# Altium schematic sheet SolidStateTeslaCoil_GateCoilDriver_SCHEMATIC.SchDoc
size A; SheetNumber: 2; SheetTotal: 2
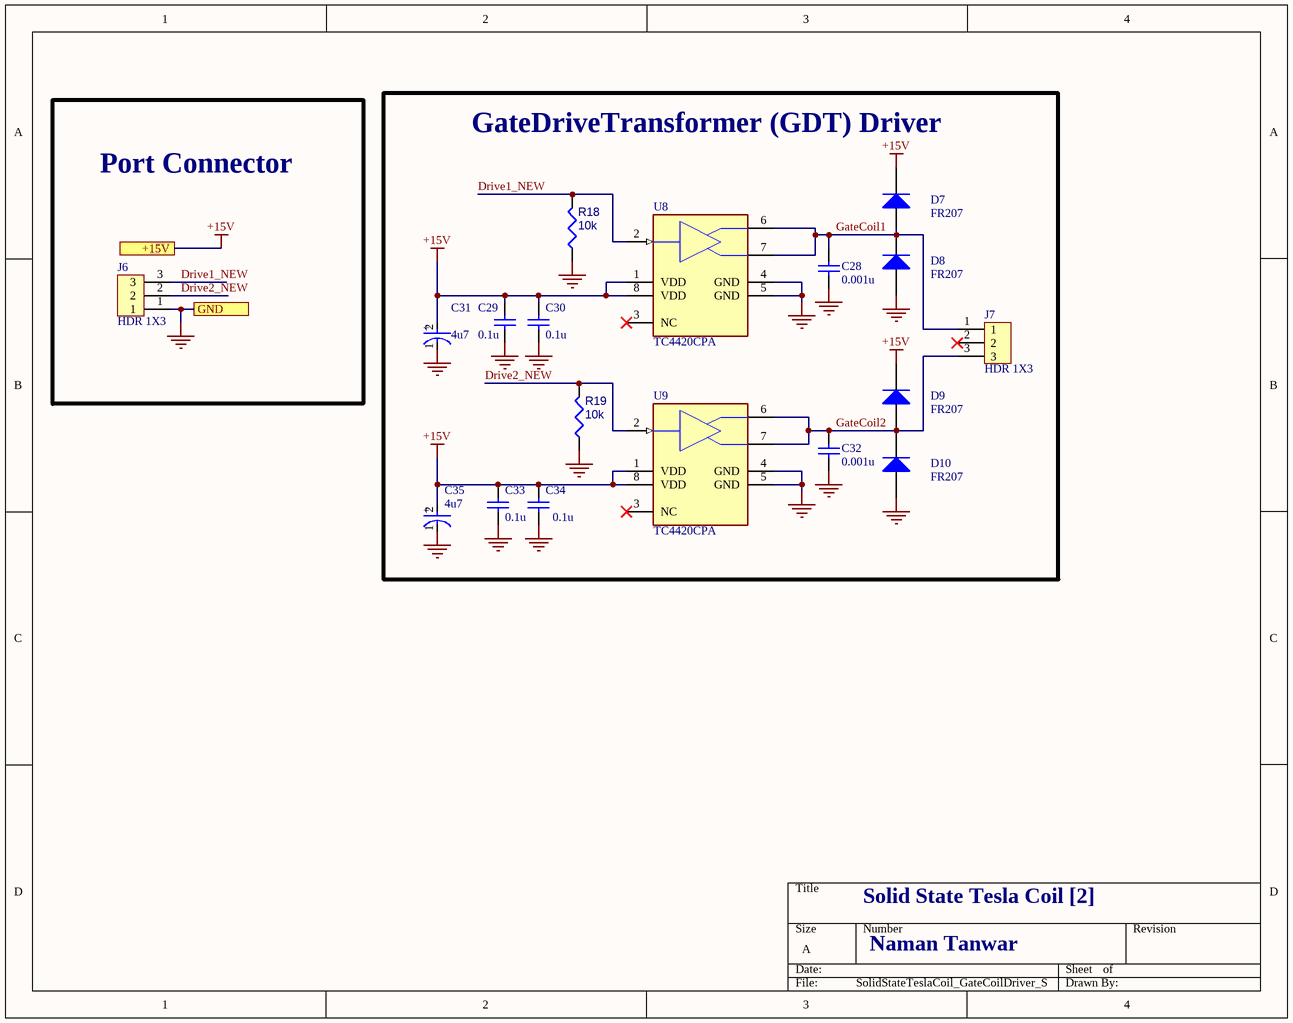
[diagram p0: SolidStateTeslaCoil_GateCoilDriver_SCHEMATIC.SchDoc]

## Parts
C28  0.001u  [Ceramic Capacitor THT]
C29  0.1u  [Ceramic Capacitor THT]
C30  0.1u  [Ceramic Capacitor THT]
C31  4u7  [FP-RAD-TH-D_5_0_5-L_11_1-MFG]
C32  0.001u  [Ceramic Capacitor THT]
C33  0.1u  [Ceramic Capacitor THT]
C34  0.1u  [Ceramic Capacitor THT]
C35  4u7  [FP-RAD-TH-D_5_0_5-L_11_1-MFG]
D7  FR207  [Diode]
D8  FR207  [Diode]
D9  FR207  [Diode]
D10  FR207  [Diode]
J6  HDR 1X3  [HDR_1x3_2.54mm]
J7  HDR 1X3  [HDR_1x3_2.54mm]
R18  10k  [RESA60-630X240]
R19  10k  [RESA60-630X240]
U8  TC4420CPA  [8PinDIP]
U9  TC4420CPA  [8PinDIP]

## Blocks framed on the sheet
Port Connector: J6
GateDriveTransformer (GDT) Driver: C28-C35 D7-D10 J7 R18 R19 U8 U9

## Ports
+15V (see SolidStateTeslaCoil_SCHEMATIC[1B]), GND (see SolidStateTeslaCoil_SCHEMATIC[1B])

## Nets
+15V: C29.2 C30.2 C31.2(A) C33.2 C34.2 C35.2(A) D7.2(K) D9.2(K) U8.1(VDD) U8.8(VDD) U9.1(VDD) U9.8(VDD) ; port +15V
GND: C28.1 C29.1 C30.1 C31.1(C) C32.1 C33.1 C34.1 C35.1(C) D8.1(A) D10.1(A) J6.1 R18.1 R19.1 U8.4(GND) U8.5(GND) U9.4(GND) U9.5(GND) ; port GND
Drive1_NEW: J6.3 R18.2 U8.2(IN)
Drive2_NEW: J6.2 R19.2 U9.2(IN)
GateCoil1: C28.2 D7.1(A) D8.2(K) J7.1 U8.6(OUT) U8.7(OUT)
GateCoil2: C32.2 D9.1(A) D10.2(K) J7.3 U9.6(OUT) U9.7(OUT)

Not connected (* = marked no-connect by the designer): J7 2*; U8 3(NC)*; U9 3(NC)*

## Notes on the sheet
- Solid State Tesla Coil [2]
- Naman Tanwar
- (in symbol 4u7 Electrolytic Capacitor) +

## Library data of the parts
C28 C32 = 0.001u 102 Ceramic Capacitor: Ceramic Capacitor, 1 nF, +/- 10%, 50 V, -55 to 125 degC, 2-Pin THD, RoHS, Tape and Reel; Manufacturer: Vishay; Other Names: BC1084CT; Catalog Drawings: Mono-KapSide2-15_5.58Mono-KapSide1_15; Temperature Coefficient: X7R; Voltage - Rated: 50V; Online Catalog: Mono-Kap™Series; Capacitance: 0.1µF; Size / Dimension: 0.157"Lx0.098"W(4.00mmx2.50mm); Operating Temperature: -55°C~125°C; Family: CeramicCapacitors; Manufacturer URL: http://www.vishay.com/; Standard Package: 1; Thickness (Max): -; Ratings: -; Datasheet Version: 08/2013; Package Description: 2-Pin Through Hole Device, Body 4 x 2.6 mm; Mounting Type: ThroughHole; Features: -; Lead Spacing: 0.098"(2.50mm); Tolerance: ±10%; Category: Capacitors; Mounting Technology: ThroughHole; Lead Style: Straight; Datasheet URL: http://www.vishay.com/docs/45171/kseries.pdf; Applications: GeneralPurpose; Package / Case: Radial; Height - Seated (Max): 0.220"(5.58mm); Package Reference: K104K15X7RF5TL2; Series: Mono-Kap™K; Packaging: CutTape(CT)
C29 C30 C33 C34 = 0.1u 104 Ceramic Capacitor: Ceramic Capacitor, 100 nF, +/- 10%, 50 V, -55 to 125 degC, 2-Pin THD, RoHS, Tape and Reel; Manufacturer: Vishay; Other Names: BC1084CT; Catalog Drawings: Mono-KapSide2-15_5.58Mono-KapSide1_15; Temperature Coefficient: X7R; Voltage - Rated: 50V; Online Catalog: Mono-Kap™Series; Capacitance: 0.1µF; Size / Dimension: 0.157"Lx0.098"W(4.00mmx2.50mm); Operating Temperature: -55°C~125°C; Family: CeramicCapacitors; Manufacturer URL: http://www.vishay.com/; Standard Package: 1; Thickness (Max): -; Ratings: -; Datasheet Version: 08/2013; Package Description: 2-Pin Through Hole Device, Body 4 x 2.6 mm; Mounting Type: ThroughHole; Features: -; Lead Spacing: 0.098"(2.50mm); Tolerance: ±10%; Category: Capacitors; Mounting Technology: ThroughHole; Lead Style: Straight; Datasheet URL: http://www.vishay.com/docs/45171/kseries.pdf; Applications: GeneralPurpose; Package / Case: Radial; Height - Seated (Max): 0.220"(5.58mm); Package Reference: K104K15X7RF5TL2; Series: Mono-Kap™K; Packaging: CutTape(CT)
C31 C35 = 4u7 Electrolytic Capacitor: Aluminum Electrolytic Capacitors (Radial Lead Type) AEC-Q200 Qualified 4u7uF ±20% 50V; Polarity: Polar; Ripple Current: 45mA; Impedance: 1.8R; Lead Diameter: 0.5mm; Capacitance: 2.2uF; Life (Hours): 1000Hour; Voltage Rating: 50V; Case/Package: Radial; Packaging: Tape and Reel; Diameter: 5mm; Construction: RADIAL; Mount: Through Hole; Radiation Hardening: No; Tolerance: 20%; Min Operating Temperature: -55°C; Length: 11mm; Voltage Rating (DC): 50V; Height: 11mm; Max Operating Temperature: 105°C; Package Quantity: 2000; Height - Seated (Max): 0.472inch; ESR (Equivalent Series Resistance): 1.8R; Features: General Purpose; Lead Pitch: 5mm; Series: FC; RoHS Compliant: Yes; Termination: Radial
D7-D10 = FR207: MULTICOMP         FR207            Standard Power Diode fast diode, Single, 1 kV, 2 A, 1.2 V, 60 A, 150 C; Supplier 1: Newark; Manufacturer: Multicomp; Manufacturer Part Number: FR207; RoHS: Yes; Category: Uncategorized; Pricing 1: 5=0.23, 10=0.19, 100=0.075, 1000=0.053 (USD); ComponentLink1URL: http://www.farnell.com/datasheets/1693119.pdf?src-supplier=Element14; ComponentLink1Description: http://www.farnell.com/datasheets/1693119.pdf?src-supplier=Element14; Supplier Part Number 1: 01P3472
J6 J7 = 68000-103HLF: Conn Unshrouded Header HDR 3 POS 2.54mm Solder ST Top Entry Thru-Hole BergStik® Automotive Bulk; Manufacturer: Amphenol ICC / FCI; Supplier 1: Digi-Key; Manufacturer Part Number: 68000-103HLF; RoHS: No; Category: Headers and Wire Housings; ComponentLink1URL: https://datasheet.ciiva.com/46392/1914865-46392021.pdf?src-supplier=Element14; ComponentLink1Description: https://datasheet.ciiva.com/46392/1914865-46392021.pdf?src-supplier=Element14; Supplier Part Number 1: 609-3461-ND
R18 R19 = 10k: Axial Resistor, 10 KOhm, +/- 1%, 250 mW, -55 to 155 degC, 2-Pin THD, RoHS, Bulk
U8 U9 = TC4420: 6A High-Speed MOSFET Driver, Non-Inverting, Commercial Temperature; Code_JEDEC: MS-001-BA; PackageReference: PDIP300-PA8; PackageVersion: revBB, Aug-2009; PackageDescription: 8-Lead Plastic Dual In-Line (PA) - 300 mil Body [PDIP]; DatasheetVersion: revC, Aug-2004